# Altium project PWM_Module.PrjPcb
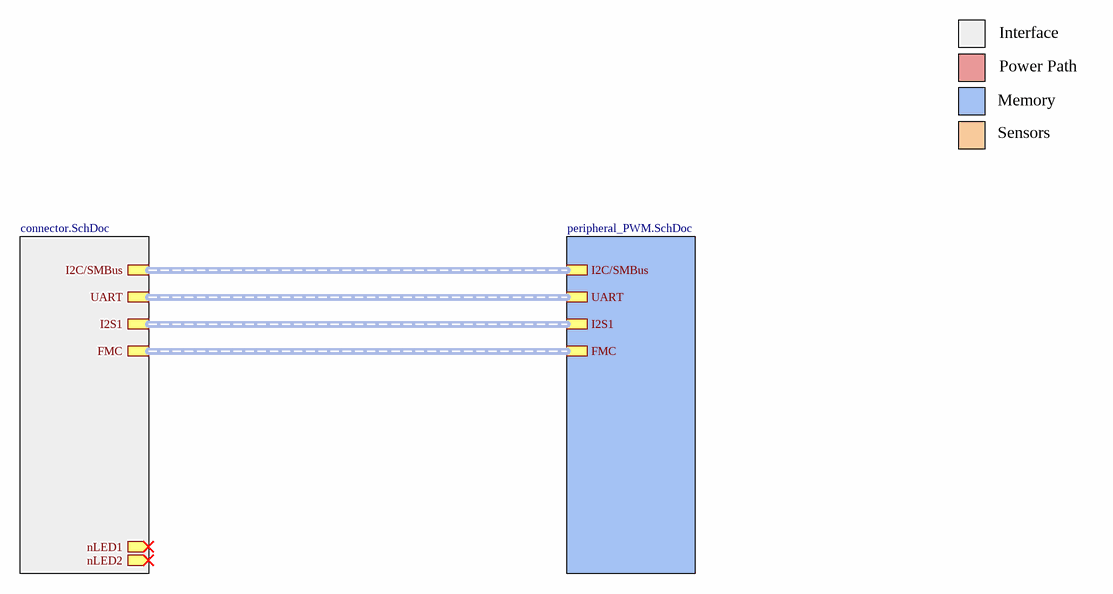
[diagram p0: main.SchDoc]
author: Philipp Mayer; institute: Integrated Systems Laboratory; organization: ETH Zurich
3 sheets, 32 parts. Net scope: hierarchical (ports join the sheet entries above them; power ports are global).
Board file: PWM_Module_TYPE2242.PcbDoc
Sheets:
  main.SchDoc
    connector = connector.SchDoc
    peripheral = peripheral_PWM.SchDoc

## Sheet main.SchDoc: uSD Card Module - Main
size A4; Author: mayerph; DrawnBy: mayerph; Organization: IIS; Revision: PA; SheetNumber: 1; SheetTotal: 3

### Sub-sheets
connector = connector.SchDoc: UART (harness UART), nLED1 (out), I2C/SMBus (harness I2C/SMBus), I2S1 (harness I2S1), nLED2 (out), FMC (harness FMC)
peripheral = peripheral_PWM.SchDoc: I2C/SMBus, UART, I2S1, FMC

### Buses and harness runs
harness sheet connector/FMC = sheet peripheral/FMC
harness sheet connector/I2C/SMBus = sheet peripheral/I2C/SMBus
harness sheet connector/I2S1 = sheet peripheral/I2S1
harness sheet connector/UART = sheet peripheral/UART

### Notes on the sheet
- Interface
- Memory
- Power Path
- Sensors
- 1
- 2
- 3
- 4
- A
- B
- C
- Project:
- D
- Date:
- Drawing number:
- Rev:
- Format:
- A4 Q
- Drawn by:
- Laboratory:
- Page
- Sheet:
- of
- File:

## Sheet connector.SchDoc: uSD Card Module - Connector
size A4; Author: mayerph; DrawnBy: mayerph; Organization: IIS; Revision: PA; SheetNumber: 2; SheetTotal: 3
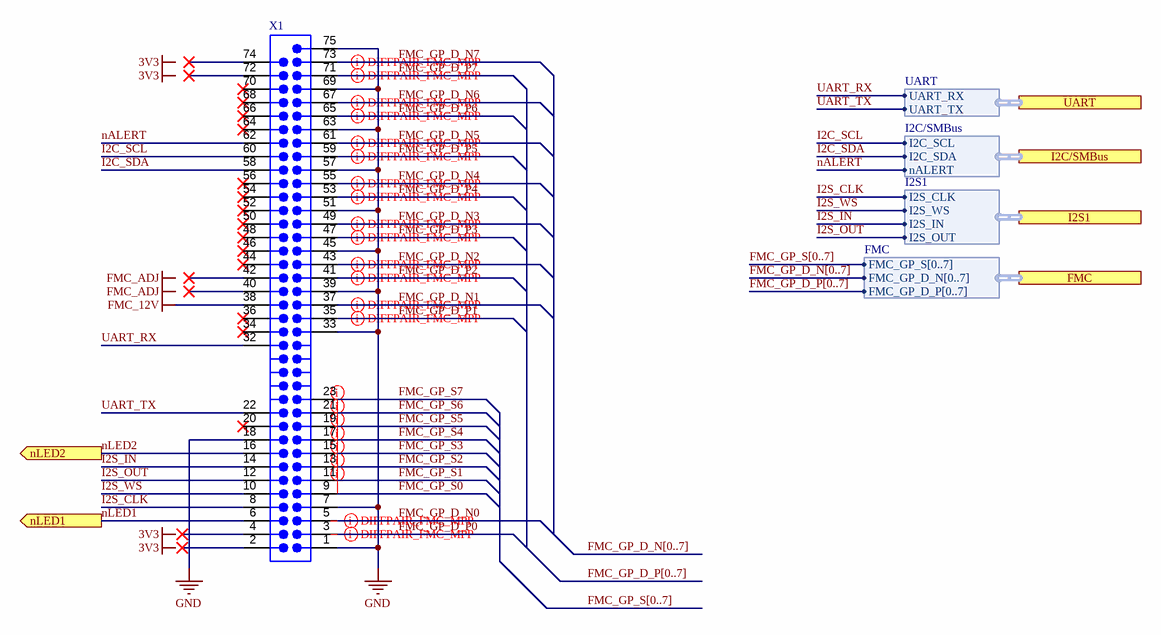
[diagram p1: connector.SchDoc]

### Parts
X1  CONN PWR CARD EDGE PCB SLOT MALE  [CON-67_0.5MM_PCB_SLOT]  (value not drawn)  (no BOM)

### Ports
FMC (harness FMC), I2C/SMBus (harness I2C/SMBus), I2S1 (harness I2S1), nLED1 (out), nLED2 (out), UART (harness UART)

### Harnesses
I2C/SMBus: I2C_SDA, I2C_SCL, nALERT
UART: UART_TX, UART_RX
I2S1: I2S_OUT, I2S_IN, I2S_WS, I2S_CLK
FMC: FMC_GP_D_N[0..7], FMC_GP_S[0..7], FMC_GP_D_P[0..7]

### Nets
FMC_12V: X1.38
GND: X1.1 X1.7 X1.18 X1.33 X1.39 X1.45 X1.51 X1.57 X1.63 X1.69 X1.75
FMC_GP_D_N0: X1.5
FMC_GP_D_N1: X1.37
FMC_GP_D_N2: X1.43
FMC_GP_D_N3: X1.49
FMC_GP_D_N4: X1.55
FMC_GP_D_N5: X1.61
FMC_GP_D_N6: X1.67
FMC_GP_D_N7: X1.73
FMC_GP_D_P0: X1.3
FMC_GP_D_P1: X1.35
FMC_GP_D_P2: X1.41
FMC_GP_D_P3: X1.47
FMC_GP_D_P4: X1.53
FMC_GP_D_P5: X1.59
FMC_GP_D_P6: X1.65
FMC_GP_D_P7: X1.71
FMC_GP_S0: X1.9
FMC_GP_S1: X1.11
FMC_GP_S2: X1.13
FMC_GP_S3: X1.15
FMC_GP_S4: X1.17
FMC_GP_S5: X1.19
FMC_GP_S6: X1.21
FMC_GP_S7: X1.23
I2C_SCL: X1.60 ; port I2C/SMBus.I2C_SCL
I2C_SDA: X1.58 ; port I2C/SMBus.I2C_SDA
I2S_CLK: X1.8 ; port I2S1.I2S_CLK
I2S_IN: X1.14 ; port I2S1.I2S_IN
I2S_OUT: X1.12 ; port I2S1.I2S_OUT
I2S_WS: X1.10 ; port I2S1.I2S_WS
nALERT: X1.62 ; port I2C/SMBus.nALERT
nLED1: X1.6 ; port nLED1
nLED2: X1.16 ; port nLED2
UART_RX: X1.32 ; port UART.UART_RX
UART_TX: X1.22 ; port UART.UART_TX

Not connected (* = marked no-connect by the designer): X1 2* 4* 20* 34* 36* 40* 42* 44* 46* 48* 50* 52(51)* 54(52)* 56(53)* 64* 66* 68* 70* 72* 74*

### Buses and harness runs
bus FMC_GP_D_N[0..7]
bus FMC_GP_D_P[0..7]
bus FMC_GP_S[0..7]

### Layout directives
differential pair; net class DP_GP; differential pair class DP_100R: (no net found under the mark), FMC_GP_D_N1, FMC_GP_D_N2, FMC_GP_D_N3, FMC_GP_D_N4, FMC_GP_D_N5, FMC_GP_D_N6, FMC_GP_D_N7, FMC_GP_D_P1, FMC_GP_D_P2, FMC_GP_D_P3, FMC_GP_D_P4, FMC_GP_D_P5, FMC_GP_D_P6, FMC_GP_D_P7
net class S_GP; net class SE_50R: FMC_GP_S0, FMC_GP_S1, FMC_GP_S2, FMC_GP_S3, FMC_GP_S4, FMC_GP_S5, FMC_GP_S6

### Notes on the sheet
- Labels drawn without touching a wire or pin: 3V3, FMC_ADJ
- 1
- 2
- 3
- 4
- A
- B
- C
- Project:
- D
- Date:
- Drawing number:
- Rev:
- Format:
- A4 Q
- Drawn by:
- Laboratory:
- Page
- Sheet:
- of
- File:

### Library data of the parts
X1 = CMP-01224-1: Mates with 2199119-4 - No BOM; Number of Positions: 67; Pitch: 0.5mm; Card Thickness: 0.8mm; Card Type: Non Specified - Dual Edge; Gender: Male; Mates with: 2199119-4

## Sheet peripheral_PWM.SchDoc: PWM Module
size A3; Author: mayerph; DrawnBy: mayerph; Organization: IIS; Revision: PA; SheetNumber: 3; SheetTotal: 3
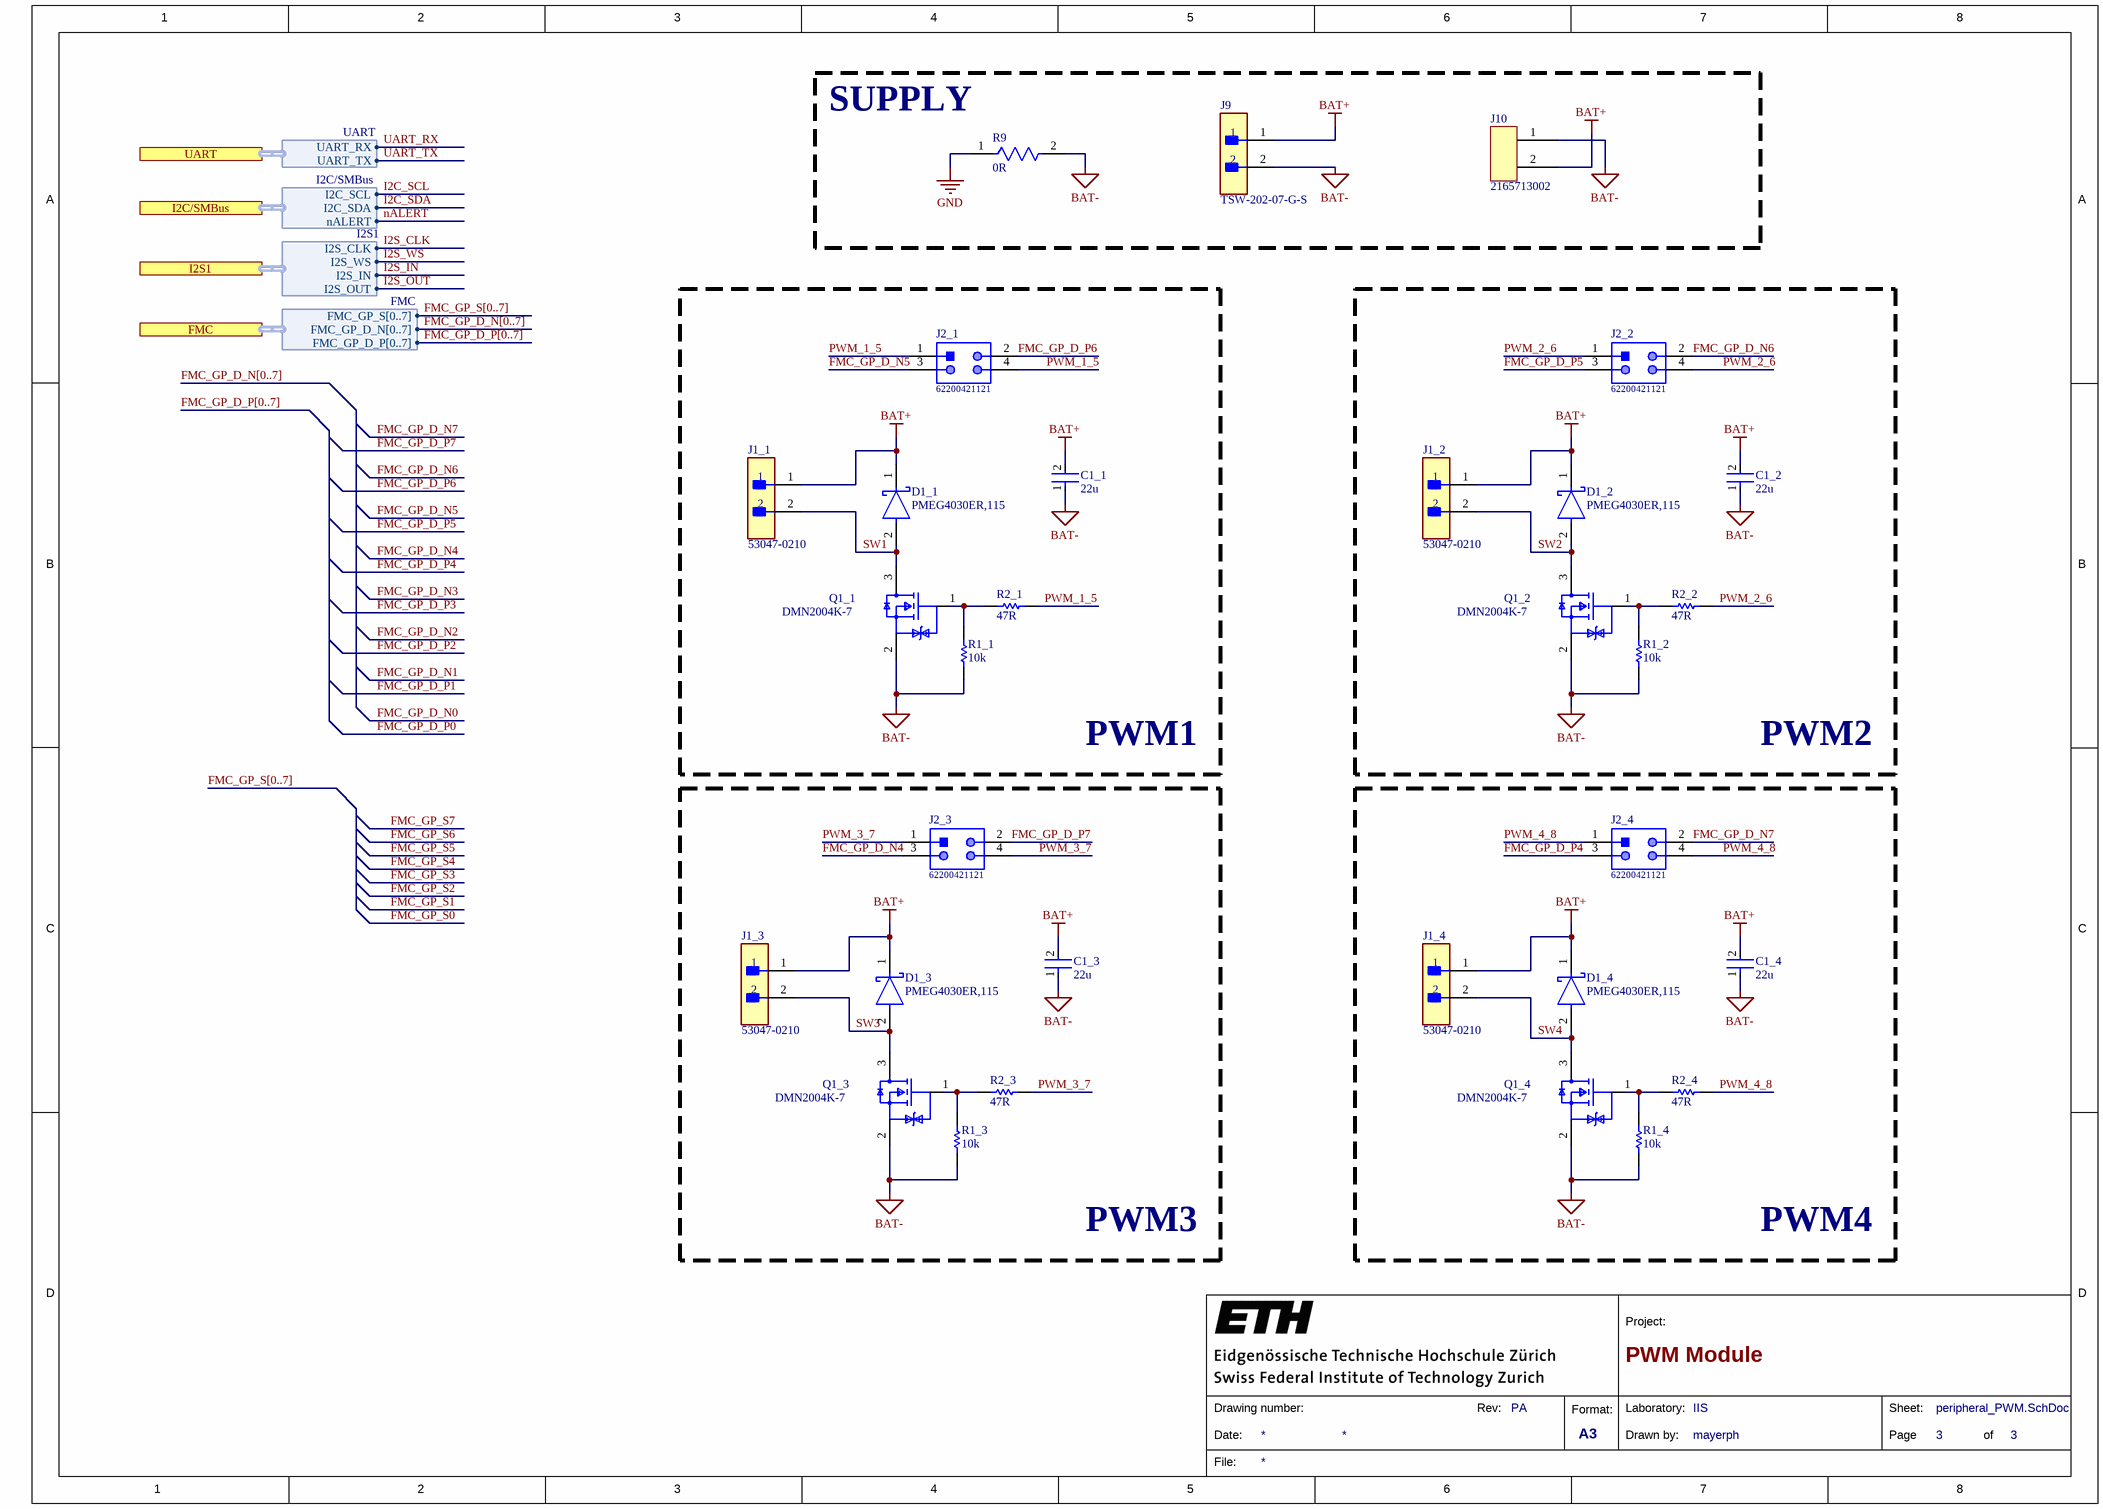
[diagram p2: peripheral_PWM.SchDoc]

### Parts
C1_1  22u  [FP-CL10-IPC_B]
C1_2  22u  [FP-CL10-IPC_B]
C1_3  22u  [FP-CL10-IPC_B]
C1_4  22u  [FP-CL10-IPC_B]
D1_1  PMEG4030ER,115  [FP-SOD123W-MFG]
D1_2  PMEG4030ER,115  [FP-SOD123W-MFG]
D1_3  PMEG4030ER,115  [FP-SOD123W-MFG]
D1_4  PMEG4030ER,115  [FP-SOD123W-MFG]
J1_1  53047-0210  [FP-53047-0210-MFG]
J1_2  53047-0210  [FP-53047-0210-MFG]
J1_3  53047-0210  [FP-53047-0210-MFG]
J1_4  53047-0210  [FP-53047-0210-MFG]
J2_1  62200421121  [62200421121]
J2_2  62200421121  [62200421121]
J2_3  62200421121  [62200421121]
J2_4  62200421121  [62200421121]
J9  TSW-202-07-G-S  [FP-TSW-202-07-G-S-MFG]
J10  2165713002  [PCBComponent_1]
Q1_1  DMN2004K-7  [FP-SOT23-MFG]
Q1_2  DMN2004K-7  [FP-SOT23-MFG]
Q1_3  DMN2004K-7  [FP-SOT23-MFG]
Q1_4  DMN2004K-7  [FP-SOT23-MFG]
R1_1  10k  [RESC1609X55X30LL15T15]
R1_2  10k  [RESC1609X55X30LL15T15]
R1_3  10k  [RESC1609X55X30LL15T15]
R1_4  10k  [RESC1609X55X30LL15T15]
R2_1  47R  [RESC1608X55X30NL15T15]
R2_2  47R  [RESC1608X55X30NL15T15]
R2_3  47R  [RESC1608X55X30NL15T15]
R2_4  47R  [RESC1608X55X30NL15T15]
R9  0R  [FP-ERJ-3GEY0R00V-MFG]

### Blocks framed on the sheet
SUPPLY: J9 J10 R9
PWM1: C1_1 D1_1 J1_1 J2_1 Q1_1 R1_1 R2_1
PWM2: C1_2 D1_2 J1_2 J2_2 Q1_2 R1_2 R2_2
PWM3: C1_3 D1_3 J1_3 J2_3 Q1_3 R1_3 R2_3
PWM4: C1_4 D1_4 J1_4 J2_4 Q1_4 R1_4 R2_4

### Ports
FMC (harness FMC), I2C/SMBus (harness I2C/SMBus), I2S1 (harness I2S1), UART (harness UART)

### Harnesses
I2C/SMBus: I2C_SDA, I2C_SCL, nALERT
UART: UART_TX, UART_RX
I2S1: I2S_OUT, I2S_IN, I2S_WS, I2S_CLK
FMC: FMC_GP_D_N[0..7], FMC_GP_S[0..7], FMC_GP_D_P[0..7]

### Nets
BAT+: C1_1.2 C1_2.2 C1_3.2 C1_4.2 D1_1.1(C) D1_2.1(C) D1_3.1(C) D1_4.1(C) J1_1.1 J1_2.1 J1_3.1 J1_4.1 J9.1 J10.2
BAT-: C1_1.1 C1_2.1 C1_3.1 C1_4.1 J9.2 J10.1 Q1_1.2(S) Q1_2.2(S) Q1_3.2(S) Q1_4.2(S) R1_1.1 R1_2.1 R1_3.1 R1_4.1 R9.2
GND: R9.1
FMC_GP_D_N4: J2_3.3
FMC_GP_D_N5: J2_1.3
FMC_GP_D_N6: J2_2.2
FMC_GP_D_N7: J2_4.2
FMC_GP_D_P4: J2_4.3
FMC_GP_D_P5: J2_2.3
FMC_GP_D_P6: J2_1.2
FMC_GP_D_P7: J2_3.2
PWM_1_5: J2_1.1 J2_1.4 R2_1.2
PWM_2_6: J2_2.1 J2_2.4 R2_2.2
PWM_3_7: J2_3.1 J2_3.4 R2_3.2
PWM_4_8: J2_4.1 J2_4.4 R2_4.2
SW1: D1_1.2(A) J1_1.2 Q1_1.3(D)
SW2: D1_2.2(A) J1_2.2 Q1_2.3(D)
SW3: D1_3.2(A) J1_3.2 Q1_3.3(D)
SW4: D1_4.2(A) J1_4.2 Q1_4.3(D)
NetQ1_1_1: Q1_1.1(G) R1_1.2 R2_1.1
NetQ1_2_1: Q1_2.1(G) R1_2.2 R2_2.1
NetQ1_3_1: Q1_3.1(G) R1_3.2 R2_3.1
NetQ1_4_1: Q1_4.1(G) R1_4.2 R2_4.1

### Buses and harness runs
bus FMC_GP_D_N[0..7]
bus FMC_GP_D_P[0..7]
bus FMC_GP_S[0..7]

### Notes on the sheet
- 1
- 2
- 3
- 4
- 5
- 6
- 7
- 8
- A
- B
- C
- D
- Project:
- Date:
- Drawing number:
- Rev:
- Format:
- A3
- Drawn by:
- Laboratory:
- Page
- Sheet:
- of
- File:

### Library data of the parts
C1_1-C1_4 = CMP-13271-002755-1: Cap Ceramic 22uF 16V X5R ±20% Pad SMD 0603 +85°C T/R; Manufacturer: Samsung; P/N: CL10A226MO7JZNC; Mount: Surface Mount; Packaging: Tape and Reel; Case Code (Imperial): 0603; Max Operating Temperature: 85°C; Capacitance: 22uF; Case/Package: 0603; Voltage Rating: 16V; Tolerance: 20%; Case Code (Metric): 1608; Min Operating Temperature: -55°C; Value: 22u; Supplier: Digi-Key; Supplier P/N: 1276-7076-1-ND
  C1_1: ClassName: PWM1
  C1_2: ClassName: PWM2
  C1_3: ClassName: PWM3
  C1_4: ClassName: PWM4
D1_1-D1_4 = CMP-14398-000026-1: DIODE SCHOTTKY 40V 3A SOD123W; Manufacturer: Nexperia USA Inc.; RoHS Compliant: Yes; Supplier: Digi-Key; P/N: PMEG4030ER,115; Supplier P/N: 1727-5313-1-ND
  D1_1: ClassName: PWM1
  D1_2: ClassName: PWM2
  D1_3: ClassName: PWM3
  D1_4: ClassName: PWM4
J1_1-J1_4 = CMP-2000-05628-3: CONN HEADER VERT 2POS 1.25MM; Manufacturer: Molex; Conn Gender: Male; Voltage Rating: 125V; Conn Orientation: Vertical; Number Of Contacts: 2; Current Rating: 1A; P/N: 0530470210; Contact Material: Tin; Temperature Range Low: -40°C; ComponentLink2URL: http://www.molex.com/webdocs/datasheets/pdf/en-us/0530470210_PCB_HEADERS.pdf; Mouser Description: 1.25mm Pitch PicoBlade™ Wire-to-Board Header, Vertical, with Friction Lock, 2 Circuits; Manufacturer Part Number: 53047-0210; Temperature Range High: +85°C; ComponentLink2Description: Datasheet; Automotive: No; RoHS: TRUE; Ambient Temperature Range High: +85°C; Octopart: https://octopart.com/53047-0210-molex-276772; Footprint Url: https://www.molex.com/pdm_docs/sd/530470210_sd.pdf; Lead Free: Yes; Pitch: 1.25mm; Temperature: -40°C to +85°C; Device Class L2: Headers and Wire Housings; Package: 0; Ambient Temperature Range Low: -40°C; Digikey Description: CONN HEADER VERT 2POS 1.25MM; Category: Conn; Device Class L3: unset; Number Of Rows: 1; Device Class L1: Connectors; Height: 4.4mm; Supplier: Digi-Key; Supplier P/N: WM1731-ND
  J1_1: ClassName: PWM1
  J1_2: ClassName: PWM2
  J1_3: ClassName: PWM3
  J1_4: ClassName: PWM4
J2_1-J2_4 = CMP-1502-00946-1: THT Vertical Pin Header WR-PHD, Pitch 1.27 mm, Dual Row, 4 pins; Manufacturer: Wurth Elektronik; Gender: Male; Contact Resistance: 20mOhm; Pitch: 1.27mm; Rated Current: 1A; Withstanding Voltage: 500VAC; Pin Number: 4; Working Voltage: 100VAC; Part Number: 62200421121; Datasheet URL: https://katalog.we-online.de/em/datasheet/62200421121.pdf; Publisher: WurthElektronik; Mounting Technology: THT; Package Reference: 62200421121; Operating Temperature: -40to105degC; Orientation: Vertical; Row Number: Dual; Packaging: Box; Manufacturer URL: http://www.we-online.de; P/N: 62200421121; Supplier: Digi-Key; Supplier P/N: 732-5372-ND
  J2_1: ClassName: PWM1
  J2_2: ClassName: PWM2
  J2_3: ClassName: PWM3
  J2_4: ClassName: PWM4
J9 = CMP-02766-000055-1: CONN HEADER VERT 2POS 5.08MM; Manufacturer: Samtec; Voltage Rating: 550V; Current Rating: 6.3A; Number Of Contacts: 2; Conn Orientation: Vertical; Conn Gender: Male; Automotive: No; Footprint Url: http://suddendocs.samtec.com/prints/tsw-xxx-xx-x-x-xx-xxx-footprint.pdf; Contact Material: Gold,Nickel; Temperature Range High: +125°C; Digikey Description: CONN HEADER VERT 2POS 5.08MM; Package: 0; Category: Conn; Pitch: 5.08mm; Device Class L1: Connectors; Device Class L3: unset; Temperature: -55°C to +125°C; Height: 8.71mm; Lead Free: Yes; Device Class L2: Headers and Wire Housings; ComponentLink2URL: http://suddendocs.samtec.com/prints/tsw-xxx-xx-xxx-x-xx-xxx-mkt.pdf; Octopart: https://octopart.com/tsw-202-07-g-s-samtec-13117432; Manufacturer Part Number: TSW-202-07-G-S; RoHS: TRUE; Temperature Range Low: -55°C; Number Of Rows: 1; ComponentLink2Description: Datasheet; Supplier: Digi-Key; P/N: TSW-202-07-G-S; Supplier P/N: SAM13323-ND
J10 = 2165713002: Micro-Fit+ Vertical Header, Through Hole, 3.00mm Pitch, Single Row, 2 Circuits, 0.76µm Gold (Au) Plating, Glow-Wire Capable, Black; Manufacturer: Molex; Supplier: Digi-Key; P/N: 2165713002; Supplier P/N: 900-2165713002-ND
Q1_1-Q1_4 = CMP-12801-000057-1: MOSFET N-CH 20V 0.63A SOT23-3; Manufacturer: Diodes Inc.; Drain To Source Resistance: 0.4Ω; Turn Off Delay Time: 59.4ns; Continuous Drain Current: 630mA; Pulse Drain Current: 1.5A; Gate To Source Voltage: 8V; Reverse Recovery Time: 5.5ns; Number Of N Channels: 1; Depletion Mode: False; Max Forward Diode Voltage: 1V; Threshold Vgs Min: 0.5V; Turn On Delay Time: 5.7ns; Standoff Height: 0.013mm; Input Capacitace At Vds: 150pF @ 16V; Rthja Max: 357°C/W; Reverse Recovery Charge: 0.85nC; Automotive Grade: Grade 0; Max Junction Temp: +150°C; Power Dissipation: 350mW; Gate Charge At Vgs: 0.9nC @ 4.5V; P/N: DMN2024UQ-7; Octopart: https://octopart.com/dmn2004k-7-diodes+inc.-7127688; Mouser Description: MOSFET 20V 540mA; Lead Free: Yes; Footprint Url: https://www.diodes.com/assets/Package-Files/SOT23.pdf; Height: 1.1mm; Temperature: -65°C to +150°C; Device Class L2: Transistors; Device Class L1: Discrete Semiconductors; ComponentLink2Description: Datasheet; RoHS: TRUE; Device Class L3: MOSFETs; Manufacturer Part Number: DMN2004K-7; Threshold Vgs Max: 1V; Number Of Channels: 1; Automotive: Yes; Category: Trans; Temperature Range Low: -65°C; Drain To Source Voltage: 20V; Drain To Source Breakdown Voltage: 20V; ComponentLink2URL: https://www.diodes.com/assets/Datasheets/ds30938.pdf; Temperature Range High: +150°C; Package: SOT23; Digikey Description: MOSFET N-CH 20V 0.63A SOT23-3; Supplier: Digi-Key; Supplier P/N: 31-DMN2024UQ-7CT-ND
  Q1_1: ClassName: PWM1
  Q1_2: ClassName: PWM2
  Q1_3: ClassName: PWM3
  Q1_4: ClassName: PWM4
R1_1-R1_4 = CMP-1012-00623-3: Chip Resistor, 10 KOhm, +/- 1%, 0.1 W, -55 to 155 degC, 0603 (1608 Metric), RoHS, Tape and Reel; Manufacturer: Panasonic; Voltage Rating: 75V; Case\/Package: 0603; Power Rating: 100mW; Resistance: 10KOhm; Temperature Coefficient: 100ppm\/degreesC; P/N: ERJ-3EKF1002V; Number of Pins: 2; Package Reference: 603; Depth: 0.8mm; Mount: SurfaceMount; Package Description: 2-Pin Surface Mount Device, Body 1.6 x 0.85 mm; Datasheet Version: 02/2017; Length: 1.6mm; Lead Free: LeadFree; Height: 0.45mm; Number of Terminations: 2; Max Power Dissipation: 100mW; Min Operating Temperature: -55degC; Datasheet URL: https://industrial.panasonic.com/cdbs/www-data/pdf/RDA0000/AOA0000C304.pdf; Termination: SMD/SMT; Case Code (Metric): 1608; Case Code (Imperial): 0603; Tolerance: 1%; Max Operating Temperature: 155degC; RoHSCompliant: true; Voltage Rating (DC): 75V; Radiation Hardening: No; Packaging: TapeandReel; Composition: ThickFilm; Mounting Technology: SurfaceMount; Manufacturer URL: http://www.panasonic.com/; Width: 0.031inch; REACH SVHC: NoSVHC; Contact Plating: Tin; Military Standard: Not; Package Quantity: 1; Value: 10k; Supplier: Digi-Key; Supplier P/N: P10.0KHCT-ND
  R1_1: ClassName: PWM1
  R1_2: ClassName: PWM2
  R1_3: ClassName: PWM3
  R1_4: ClassName: PWM4
R2_1-R2_4 = CMP-2000-00529-2: Chip Resistor, 47 Ohm, +/- 1%, 0.1 W, -55 to 155 degC, 0603 (1608 Metric), RoHS, Tape and Reel; Manufacturer: Panasonic; Power Rating: 100 mW; Case\Package: 0603; Voltage Rating (DC): 50 V; Resistance: 6.8 kohm; P/N: ERJ-3EKF47R0V; Length: 1.6 mm; Case Code (Metric): 1608; Packaging: Tape and Reel; Min Operating Temperature: -55 degC; DatasheetVersion: Apr-15; PackageReference: 0603; Case Code (Imperial): 0603; PackageDescription: 2-Pin Surface Mount Device, Body 1.6 x 0.85 mm; Tolerance: 1%; Height: 0.45 mm; RoHSCompliant: true; ComponentLink2Description: Datasheet; Pins: 2; ComponentLink1URL: http://www.panasonic.com/; Package Quantity: 5000; REACH SVHC: No SVHC; ComponentLink2URL: http://industrial.panasonic.com/cdbs/www-data/pdf/RDA0000/AOA0000C86.pdf; Width: 0.8 mm; Mount: Surface Mount; Max Operating Temperature: 155 degC; ComponentLink1Description: Manufacturer URL; Voltage Rating: 50 V; Value: 47R; Supplier: Digi-Key; Supplier P/N: P47.0HCT-ND
  R2_1: ClassName: PWM1
  R2_2: ClassName: PWM2
  R2_3: ClassName: PWM3
  R2_4: ClassName: PWM4
R9 = CMP-2000-00700-2: RES SMD 0 OHM JUMPER 1/10W 0603; Manufacturer Part Number: ERJ-3GEY0R00V; Manufacturer: Panasonic; Tolerance: 5%; Automotive Grade: Grade 0; Voltage Rating: 75V; Resistance: 0Ω; Temperature Coefficient: -100/+600ppm/°C; Power Rating: 0.1W; Mouser Description: Resistor, Chip Thick Film, 0 Ohm, 0.1w, Resistor, Chip Thick Film, 0 Ohm, 0.1w, 5%; Ipc Land Pattern Name: RESC16080X45; Category: Res; Package: 0603; Temperature: -55°C to +155°C; Value: 0R; Temperature Range Low: -55°C; Series: ERJ; RoHS: TRUE; Composition: Thick Film; Octopart: https://octopart.com/erj-3gey0r00v-panasonic-55389238; Device Class L1: Passive Components; Footprint Url: https://industrial.panasonic.com/cdbs/www-data/pdf/RDA0000/DMA0000COL17.pdf; ComponentLink2Description: Datasheet; Device Class L2: Resistors; Temperature Range High: +155°C; Digikey Description: RES SMD 0 OHM JUMPER 1/10W 0603; Lead Free: Yes; Device Class L3: Chip SMD Resistors; Height: 0.55mm; ComponentLink2URL: https://industrial.panasonic.com/cdbs/www-data/pdf/RDA0000/AOA0000C301.pdf; Automotive: Yes; Supplier: Digi-Key; P/N: ERJ-3GEY0R00V; Supplier P/N: P0.0GCT-ND

## Nets that join several sheets
GND: connector (11 pins), peripheral_PWM (R9.1)
FMC_GP_D_N4: connector (X1.55), peripheral_PWM (J2_3.3)
FMC_GP_D_N5: connector (X1.61), peripheral_PWM (J2_1.3)
FMC_GP_D_N6: connector (X1.67), peripheral_PWM (J2_2.2)
FMC_GP_D_N7: connector (X1.73), peripheral_PWM (J2_4.2)
FMC_GP_D_P4: connector (X1.53), peripheral_PWM (J2_4.3)
FMC_GP_D_P5: connector (X1.59), peripheral_PWM (J2_2.3)
FMC_GP_D_P6: connector (X1.65), peripheral_PWM (J2_1.2)
FMC_GP_D_P7: connector (X1.71), peripheral_PWM (J2_3.2)